# Altium schematic sheet PowerGroup.SchDoc
size A4
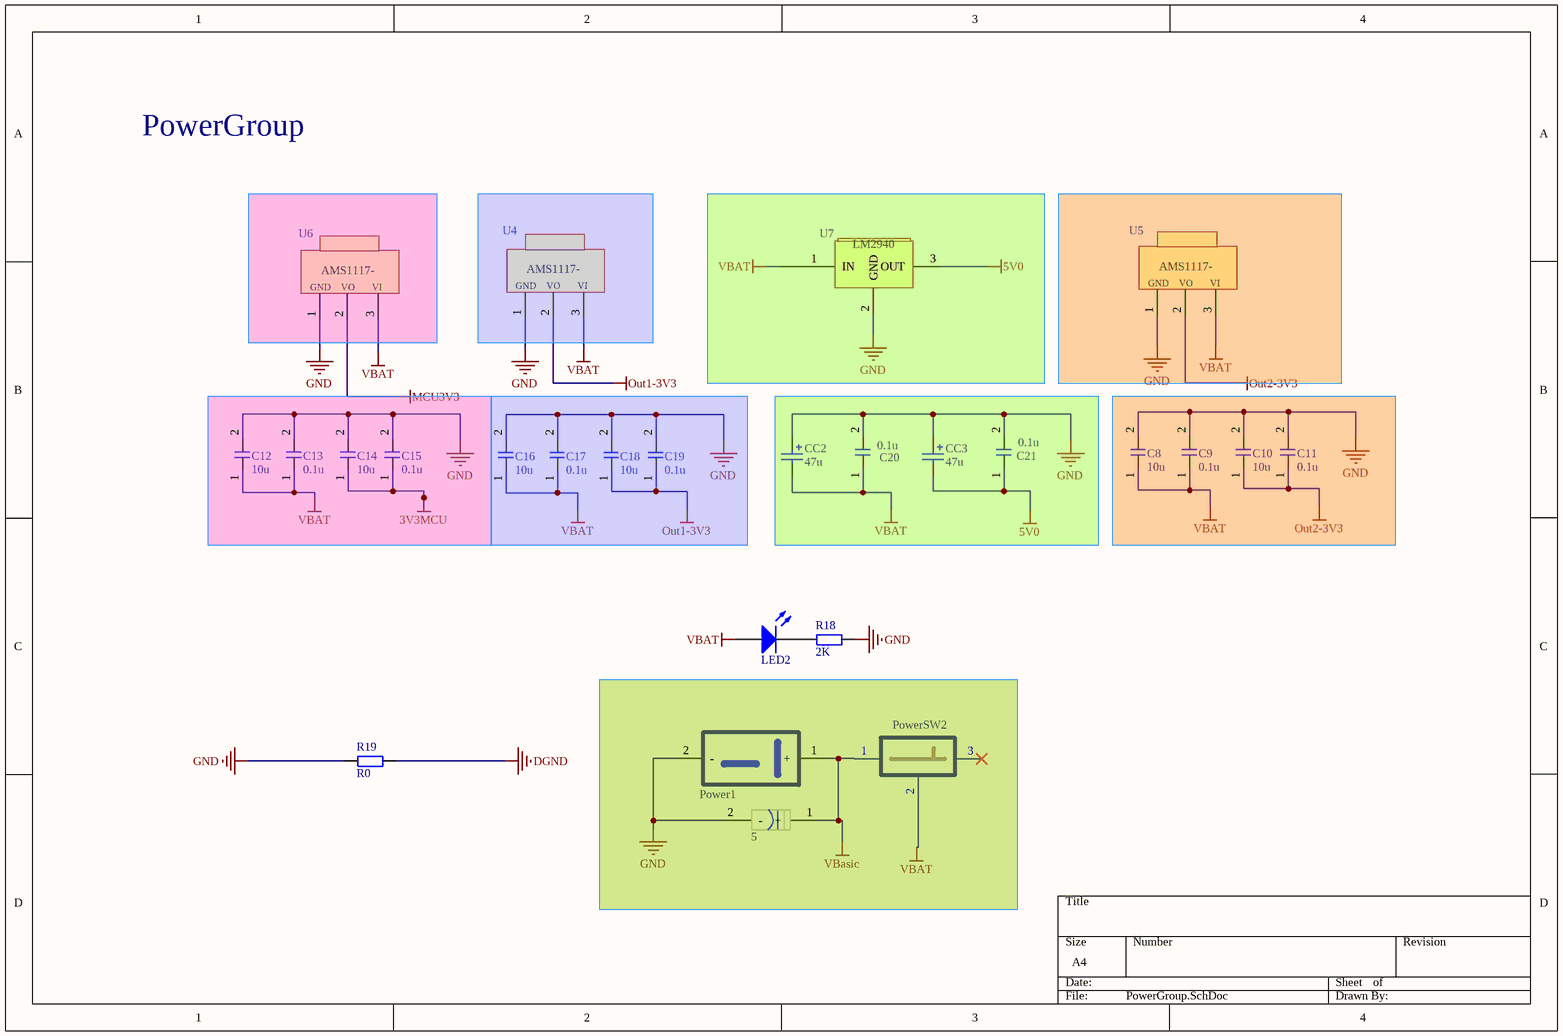
[diagram p0: PowerGroup.SchDoc]

## Parts
5  钽电容  [钽D]  (value not drawn)
C8  10u  [0805电容]
C9  0.1u  [0805电容]
C10  10u  [0805电容]
C11  0.1u  [0805电容]
C12  10u  [0805电容]
C13  0.1u  [0805电容]
C14  10u  [0805电容]
C15  0.1u  [0805电容]
C16  10u  [0805电容]
C17  0.1u  [0805电容]
C18  10u  [0805电容]
C19  0.1u  [0805电容]
C20  0.1u  [0805电容]
C21  0.1u  [0805电容]
CC2  Capacitance: 47u  [CAPMP6032X26N]  (hidden comment: Cap Tan C)
CC3  Capacitance: 47u  [CAPMP6032X26N]  (hidden comment: Cap Tan C)
LED2  0805LED  [0805LED]  (value not drawn)
Power1  XT60  [XT60]  (value not drawn)
PowerSW2  Power  [PowerSW]  (value not drawn)
R18  2K  [0805电阻]
R19  R0  [0805电阻]
U4  AMS1117-  [AMS1117-]  (value not drawn)
U5  AMS1117-  [AMS1117-]  (value not drawn)
U6  AMS1117-  [AMS1117-]  (value not drawn)
U7  LM2940  [LM2940]  (value not drawn)

## Nets
3V3MCU: C14.1 C15.1
5V0: C21.1 CC3.1 U7.3(OUT)
DGND: R19.1
GND: 5.2(-) C8.2 C9.2 C10.2 C11.2 C12.2 C13.2 C14.2 C15.2 C16.2 C17.2 C18.2 C19.2 C20.2 C21.2 CC2.2 CC3.2 Power1.2(-) R18.1 R19.2 U4.1(GND) U5.1(GND) U6.1(GND) U7.2(GND)
MCU3V3: U6.2(Vout)
Out1-3V3: C18.1 C19.1 U4.2(Vout)
Out2-3V3: C10.1 C11.1 U5.2(Vout)
VBasic: 5.1(+) Power1.1(+) PowerSW2.1
VBAT: C8.1 C9.1 C12.1 C13.1 C16.1 C17.1 C20.1 CC2.1 LED2.1(A) PowerSW2.2 U4.3(Vin) U5.3(Vin) U6.3(Vin) U7.1(IN)
NetLED2_2: LED2.2(K) R18.2

Not connected (* = marked no-connect by the designer): PowerSW2 3*

## Notes on the sheet
- PowerGroup
- (in symbol AMS1117-) VO; VI

## Library data of the parts
C8-C21 = 0805电容
CC2 CC3 = Cap Tan C: Polarized Capacitor (Radial); Voltage: 16V; Published: 8-Jun-2000; Revision: July-2002: Re-released for DXP Platform.; Publisher: Altium Limited
PowerSW2 = PowerSW
R18 R19 = 0805电阻